# EAGLE schematic Daughter Card (EAGLE 6.5.1)
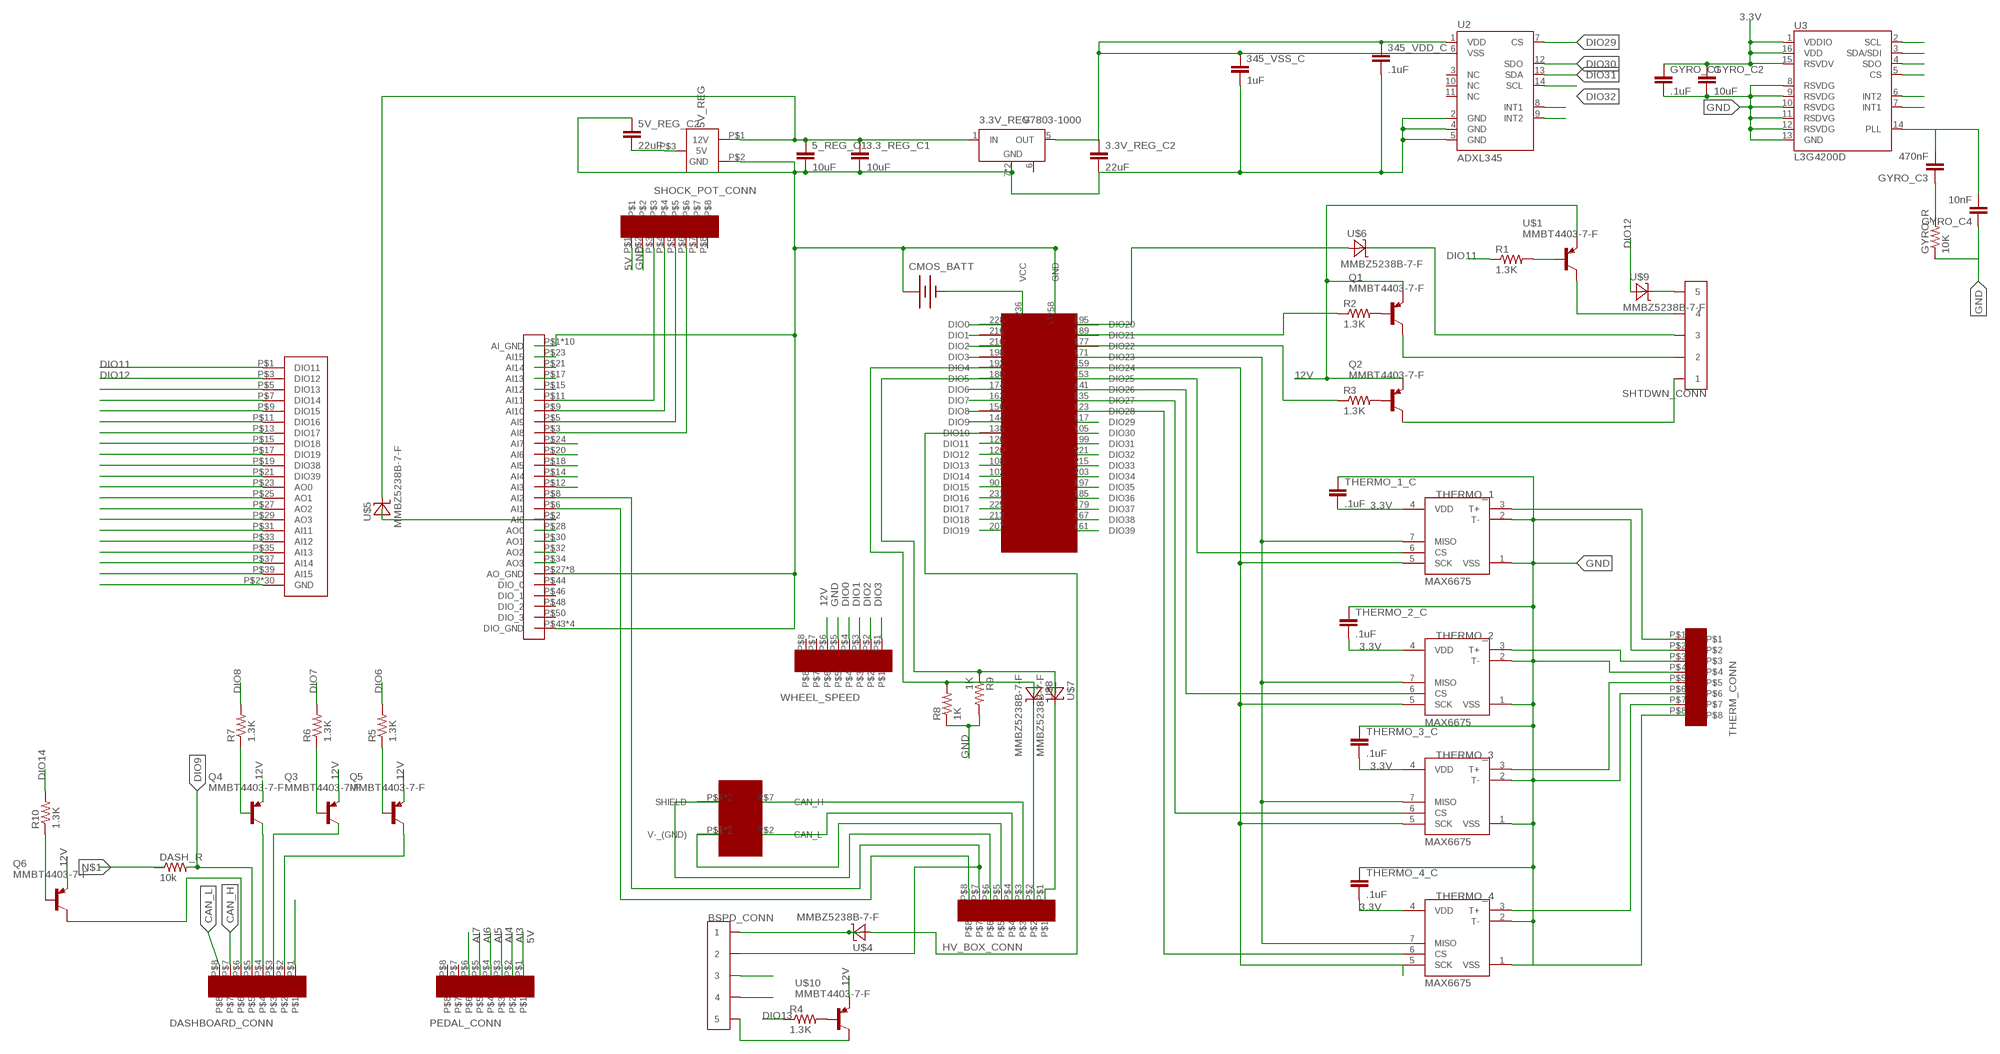
[diagram p0: schematic, sheet 1]

## Parts
3.3_REG_C1  10uF  CAP0603-CAP  [0603-CAP]
3.3V_REG  V7803-1000  [V78XX-1000]
3.3V_REG_C2  22uF  CAP0603-CAP  [0603-CAP]
5_REG_C1  10uF  CAP0603-CAP  [0603-CAP]
5V_REG  V78XX-1500  [V78XX-1500R]
5V_REG_C2  22uF  CAP0603-CAP  [0603-CAP]
345_VDD_C  .1uF  CAP0603-CAP  [0603-CAP]
345_VSS_C  1uF  CAP0603-CAP  [0603-CAP]
BSPD_CONN  CONN_5  [CONNECTOR_5]
CMOS_BATT  BATTERY20PTH  [BATTCOM_20MM_PTH]
DASH_R  10k  10K-1%RES-00824  [0603-RES]
DASHBOARD_CONN  EN3_PCB_8  [EN3_PCB_8]
GYRO_C1  .1uF  CAP0603-CAP  [0603-CAP]
GYRO_C2  10uF  CAP0603-CAP  [0603-CAP]
GYRO_C3  470nF  CAP0603-CAP  [0603-CAP]
GYRO_C4  10nF  CAP0603-CAP  [0603-CAP]
GYRO_R  10K  RESISTOR0603-RES  [0603-RES]
HV_BOX_CONN  EN3_PCB_8  [EN3_PCB_8]
PEDAL_CONN  EN3_PCB_8  [EN3_PCB_8]
Q1  MMBT4403-7-F  [SOT-23-3]
Q2  MMBT4403-7-F  [SOT-23-3]
Q3  MMBT4403-7-F  [SOT-23-3]
Q4  MMBT4403-7-F  [SOT-23-3]
Q5  MMBT4403-7-F  [SOT-23-3]
Q6  MMBT4403-7-F  [SOT-23-3]
R1  1.3K  R-US_R0402  [R0402]
R2  1.3K  R-US_R0402  [R0402]
R3  1.3K  R-US_R0402  [R0402]
R4  1.3K  R-US_R0402  [R0402]
R5  1.3K  R-US_R0402  [R0402]
R6  1.3K  R-US_R0402  [R0402]
R7  1.3K  R-US_R0402  [R0402]
R8  1K  R-US_R0402  [R0402]
R9  1K  R-US_R0402  [R0402]
R10  1.3K  R-US_R0402  [R0402]
SBRIO_ANALOG  SBRIO_MIO  [SBRIO_J502_J503]
SBRIO_AUX  SBRIO_AUX  [SBRIO_J502_J503]
SHOCK_POT_CONN  EN3_PCB_8  [EN3_PCB_8]
SHTDWN_CONN  CONN_5  [CONNECTOR_5]
THERM_CONN  EN3_PCB_8  [EN3_PCB_8]
THERMO_1  MAX6675  [SO08]
THERMO_1_C  .1uF  CAP0603-CAP  [0603-CAP]
THERMO_2  MAX6675  [SO08]
THERMO_2_C  .1uF  CAP0603-CAP  [0603-CAP]
THERMO_3  MAX6675  [SO08]
THERMO_3_C  .1uF  CAP0603-CAP  [0603-CAP]
THERMO_4  MAX6675  [SO08]
THERMO_4_C  .1uF  CAP0603-CAP  [0603-CAP]
U2  ADXL345  [LGA14]
U3  L3G4200D  [LGA16-4X4]
U$1  MMBT4403-7-F  [SOT-23-3]
U$2  SBRIO_W500  [SBRIO_W]
U$3  SBRIO_RMC  [SEAM-40-XX.X-XX-06-X-A]
U$4  MMBZ5238B-7-F  [SOT-23-3]
U$5  MMBZ5238B-7-F  [SOT-23-3]
U$6  MMBZ5238B-7-F  [SOT-23-3]
U$7  MMBZ5238B-7-F  [SOT-23-3]
U$8  MMBZ5238B-7-F  [SOT-23-3]
U$9  MMBZ5238B-7-F  [SOT-23-3]
U$10  MMBT4403-7-F  [SOT-23-3]
WHEEL_SPEED  EN3_PCB_8  [EN3_PCB_8]

## Nets
3.3V: 3.3V_REG.5(OUT) 3.3V_REG_C2.1 345_VDD_C.1 345_VSS_C.1 GYRO_C1.1 GYRO_C2.1 THERMO_1.4(VDD) THERMO_1_C.2 THERMO_2.4(VDD) THERMO_2_C.2 THERMO_3.4(VDD) THERMO_3_C.2 THERMO_4.4(VDD) THERMO_4_C.2 U2.1(VDD) U2.6(VSS) U3.1(VDDIO) U3.15(RSVDV) U3.16(VDD)
5V: 5V_REG.P$3(5V) 5V_REG_C2.2 DASHBOARD_CONN.P$1 PEDAL_CONN.P$1 SHOCK_POT_CONN.P$1
12V: 3.3_REG_C1.1 3.3V_REG.1(IN) 5_REG_C1.1 5V_REG.P$1(12V) Q1.P$3(E) Q2.P$3(E) Q3.P$3(E) Q4.P$3(E) Q5.P$3(E) Q6.P$3(E) U$1.P$3(E) U$5.P$1(C) U$10.P$3(E) WHEEL_SPEED.P$6
AI3: BSPD_CONN.5 BSPD_CONN.6 PEDAL_CONN.P$2 SBRIO_ANALOG.P$12(AI3)
AI4: BSPD_CONN.7 BSPD_CONN.8 PEDAL_CONN.P$3 SBRIO_ANALOG.P$14(AI4)
AI5: PEDAL_CONN.P$4 SBRIO_ANALOG.P$18(AI5)
AI6: PEDAL_CONN.P$5 SBRIO_ANALOG.P$20(AI6)
AI7: PEDAL_CONN.P$6 SBRIO_ANALOG.P$24(AI7)
AI11: SBRIO_ANALOG.P$11(AI11) SBRIO_AUX.P$31(AI11) SHOCK_POT_CONN.P$3
AI12: SBRIO_ANALOG.P$15(AI12) SBRIO_AUX.P$33(AI12)
AI13: SBRIO_ANALOG.P$17(AI13) SBRIO_AUX.P$35(AI13)
AI14: SBRIO_ANALOG.P$21(AI14) SBRIO_AUX.P$37(AI14)
AI15: SBRIO_ANALOG.P$23(AI15) SBRIO_AUX.P$39(AI15)
AO0: SBRIO_ANALOG.P$28(AO0) SBRIO_AUX.P$23(AO0)
AO1: SBRIO_ANALOG.P$30(AO1) SBRIO_AUX.P$25(AO1)
AO2: SBRIO_ANALOG.P$32(AO2) SBRIO_AUX.P$27(AO2)
AO3: SBRIO_ANALOG.P$34(AO3) SBRIO_AUX.P$29(AO3)
CAN_H: DASHBOARD_CONN.P$7 HV_BOX_CONN.P$3 U$2.P$7(CAN_H)
CAN_L: DASHBOARD_CONN.P$8 HV_BOX_CONN.P$4 U$2.P$2(CAN_L)
DIO0: U$3.228(DIO0) WHEEL_SPEED.P$4
DIO1: U$3.216(DIO1) WHEEL_SPEED.P$3
DIO2: U$3.210(DIO2) WHEEL_SPEED.P$2
DIO3: U$3.198(DIO3) WHEEL_SPEED.P$1
DIO6: R5.2 U$3.174(DIO6)
DIO7: R6.2 U$3.162(DIO7)
DIO8: R7.2 U$3.156(DIO8)
DIO9: DASH_R.2 DASHBOARD_CONN.P$5 U$3.144(DIO9)
DIO11: R1.1 SBRIO_AUX.P$1(DIO11) U$3.126(DIO11)
DIO12: SBRIO_AUX.P$3(DIO12) U$3.120(DIO12) U$9.P$2(A)
DIO13: R4.1 SBRIO_AUX.P$5(DIO13) U$3.108(DIO13)
DIO14: R10.2 SBRIO_AUX.P$7(DIO14) U$3.102(DIO14)
DIO15: SBRIO_AUX.P$9(DIO15) U$3.90(DIO15)
DIO16: SBRIO_AUX.P$11(DIO16) U$3.231(DIO16)
DIO17: SBRIO_AUX.P$13(DIO17) U$3.225(DIO17)
DIO18: SBRIO_AUX.P$15(DIO18) U$3.213(DIO18)
DIO19: SBRIO_AUX.P$17(DIO19) U$3.207(DIO19)
DIO29: U2.7(CS) U$3.117(DIO29)
DIO30: U2.12(SDO) U3.4(SDO) U$3.105(DIO30)
DIO31: U2.13(SDA) U3.3(SDA/SDI) U$3.99(DIO31)
DIO32: U2.14(SCL) U3.2(SCL) U$3.221(DIO32)
DIO33: U3.5(CS) U$3.215(DIO33)
DIO34: U3.7(INT1) U$3.203(DIO34)
DIO35: U3.6(INT2) U$3.197(DIO35)
DIO36: U2.8(INT1) U$3.185(DIO36)
DIO37: U2.9(INT2) U$3.179(DIO37)
DIO38: SBRIO_AUX.P$19(DIO38) U$3.167(DIO38)
DIO39: SBRIO_AUX.P$21(DIO39) U$3.161(DIO39)
GND: 3.3_REG_C1.2 3.3V_REG.7(GND) 3.3V_REG.9(GND) 3.3V_REG_C2.2 5_REG_C1.2 5V_REG.P$2(GND) 5V_REG_C2.1 345_VDD_C.2 345_VSS_C.2 CMOS_BATT.1(+) GYRO_C1.2 GYRO_C2.2 GYRO_C4.1 GYRO_R.1 R8.1 R9.2 SBRIO_ANALOG.P$1(AI_GND) SBRIO_ANALOG.P$4(AI_GND) SBRIO_ANALOG.P$7(AI_GND) SBRIO_ANALOG.P$10(AI_GND) SBRIO_ANALOG.P$13(AI_GND) SBRIO_ANALOG.P$16(AI_GND) SBRIO_ANALOG.P$19(AI_GND) SBRIO_ANALOG.P$22(AI_GND) SBRIO_ANALOG.P$25(AI_GND) SBRIO_ANALOG.P$26(AI_GND) SBRIO_ANALOG.P$27(AO_GND) SBRIO_ANALOG.P$29(AO_GND) SBRIO_ANALOG.P$31(AO_GND) SBRIO_ANALOG.P$33(AO_GND) SBRIO_ANALOG.P$35(AO_GND) SBRIO_ANALOG.P$37(AO_GND) SBRIO_ANALOG.P$39(AO_GND) SBRIO_ANALOG.P$41(AO_GND) SBRIO_ANALOG.P$43(DIO_GND) SBRIO_ANALOG.P$45(DIO_GND) SBRIO_ANALOG.P$47(DIO_GND) SBRIO_ANALOG.P$49(DIO_GND) SBRIO_AUX.P$2(GND) SBRIO_AUX.P$4(GND) SBRIO_AUX.P$6(GND) SBRIO_AUX.P$8(GND) SBRIO_AUX.P$10(GND) SBRIO_AUX.P$12(GND) SBRIO_AUX.P$14(GND) SBRIO_AUX.P$16(GND) SBRIO_AUX.P$18(GND) SBRIO_AUX.P$20(GND) SBRIO_AUX.P$22(GND) SBRIO_AUX.P$24(GND) SBRIO_AUX.P$26(GND) SBRIO_AUX.P$28(GND) SBRIO_AUX.P$30(GND) SBRIO_AUX.P$32(GND) SBRIO_AUX.P$34(GND) SBRIO_AUX.P$36(GND) SBRIO_AUX.P$38(GND) SBRIO_AUX.P$40(GND) SBRIO_AUX.P$41(GND) SBRIO_AUX.P$42(GND) SBRIO_AUX.P$43(GND) SBRIO_AUX.P$44(GND) SBRIO_AUX.P$45(GND) SBRIO_AUX.P$46(GND) SBRIO_AUX.P$47(GND) SBRIO_AUX.P$48(GND) SBRIO_AUX.P$49(GND) SBRIO_AUX.P$50(GND) SHOCK_POT_CONN.P$2 THERM_CONN.P$2 THERM_CONN.P$4 THERMO_1.1(VSS) THERMO_1.2(T-) THERMO_1_C.1 THERMO_2.1(VSS) THERMO_2.2(T-) THERMO_2_C.1 THERMO_3.1(VSS) THERMO_3.2(T-) THERMO_3_C.1 THERMO_4.1(VSS) THERMO_4.2(T-) THERMO_4_C.1 U2.2(GND) U2.4(GND) U2.5(GND) U3.8(RSVDG) U3.9(RSVDG) U3.10(RSVDG) U3.11(RSDVG) U3.12(RSVDG) U3.13(GND) U$3.17(GND) U$3.23(GND) U$3.30(GND) U$3.36(GND) U$3.41(GND) U$3.47(GND) U$3.78(GND) U$3.83(GND) U$3.88(GND) U$3.93(GND) U$3.96(GND) U$3.98(GND) U$3.101(GND) U$3.103(GND) U$3.106(GND) U$3.111(GND) U$3.114(GND) U$3.116(GND) U$3.119(GND) U$3.121(GND) U$3.124(GND) U$3.129(GND) U$3.132(GND) U$3.134(GND) U$3.137(GND) U$3.139(GND) U$3.142(GND) U$3.147(GND) U$3.150(GND) U$3.152(GND) U$3.155(GND) U$3.157(GND) U$3.160(GND) U$3.165(GND) U$3.168(GND) U$3.170(GND) U$3.173(GND) U$3.175(GND) U$3.178(GND) U$3.183(GND) U$3.186(GND) U$3.188(GND) U$3.191(GND) U$3.193(GND) U$3.196(GND) U$3.201(GND) U$3.204(GND) U$3.206(GND) U$3.209(GND) U$3.211(GND) U$3.214(GND) U$3.219(GND) U$3.222(GND) U$3.224(GND) U$3.227(GND) U$3.229(GND) U$3.232(GND) U$3.237(GND) WHEEL_SPEED.P$5
N$: Q4.P$2(B) R7.1
N$1: DASH_R.1
N$2: CMOS_BATT.2(-) U$3.236(VCC)
N$3: DASHBOARD_CONN.P$6 Q6.P$1(C)
N$4: SBRIO_ANALOG.P$2(AI0) U$5.P$2(A)
N$5: Q6.P$2(B) R10.1
N$7: Q1.P$1(C) SHTDWN_CONN.3 SHTDWN_CONN.4
N$8: Q2.P$1(C) SHTDWN_CONN.1 SHTDWN_CONN.2
N$9: SHTDWN_CONN.5 SHTDWN_CONN.6 U$6.P$1(C)
N$10: U$3.195(DIO20) U$6.P$2(A)
N$11: R2.1 U$3.189(DIO21)
N$12: R3.1 U$3.177(DIO22)
N$13: HV_BOX_CONN.P$1 U$7.P$1(C)
N$14: HV_BOX_CONN.P$2 U$8.P$1(C)
N$15: R8.2 U$3.192(DIO4) U$8.P$2(A)
N$16: R9.1 U$3.180(DIO5) U$7.P$2(A)
N$17: THERMO_1.7(MISO) THERMO_2.7(MISO) THERMO_3.7(MISO) U$3.171(DIO23)
N$18: THERMO_1.5(SCK) THERMO_2.5(SCK) THERMO_3.5(SCK) U$3.159(DIO24)
N$19: HV_BOX_CONN.P$5 U$2.P$3(V-_(GND)) U$2.P$6(V-_(GND))
N$20: HV_BOX_CONN.P$8 SBRIO_ANALOG.P$6(AI1)
N$21: BSPD_CONN.3 BSPD_CONN.4 HV_BOX_CONN.P$7 SBRIO_ANALOG.P$8(AI2)
N$22: DASHBOARD_CONN.P$2 Q5.P$1(C)
N$23: DASHBOARD_CONN.P$3 Q3.P$1(C)
N$24: DASHBOARD_CONN.P$4 Q4.P$1(C)
N$25: THERMO_1.6(CS) U$3.153(DIO25)
N$26: U$3.141(DIO26)
N$27: THERMO_3.6(CS) U$3.135(DIO27)
N$28: THERMO_4.6(CS) U$3.123(DIO28)
N$29: THERM_CONN.P$1 THERMO_1.3(T+)
N$30: THERM_CONN.P$3 THERMO_2.3(T+)
N$31: THERM_CONN.P$5 THERMO_3.3(T+)
N$32: THERM_CONN.P$7 THERMO_4.3(T+)
N$33: SHTDWN_CONN.9 SHTDWN_CONN.10 U$9.P$1(C)
N$34: SBRIO_ANALOG.P$9(AI10) SHOCK_POT_CONN.P$4
N$35: SBRIO_ANALOG.P$5(AI9) SHOCK_POT_CONN.P$5
N$36: SBRIO_ANALOG.P$3(AI8) SHOCK_POT_CONN.P$6
N$37: GYRO_C3.2 GYRO_C4.2 U3.14(PLL)
N$38: GYRO_C3.1 GYRO_R.2
N$42: BSPD_CONN.1 BSPD_CONN.2 U$4.P$1(C)
N$43: U$3.138(DIO10) U$4.P$2(A)
N$44: SHTDWN_CONN.7 SHTDWN_CONN.8 U$1.P$1(C)
N$45: BSPD_CONN.9 BSPD_CONN.10 U$10.P$1(C)
N$46: R1.2 U$1.P$2(B)
N$47: Q1.P$2(B) R2.2
N$48: Q2.P$2(B) R3.2
N$49: R4.2 U$10.P$2(B)
N$50: Q5.P$2(B) R5.1
N$51: Q3.P$2(B) R6.1
SHIELD: HV_BOX_CONN.P$6 U$2.P$5(SHIELD) U$2.P$10(SHIELD)
Unconnected: 3.3V_REG.6 PEDAL_CONN.P$7 PEDAL_CONN.P$8 SBRIO_ANALOG.P$44(DIO_0) SBRIO_ANALOG.P$46(DIO_1) SBRIO_ANALOG.P$48(DIO_2) SBRIO_ANALOG.P$50(DIO_3) SHOCK_POT_CONN.P$7 SHOCK_POT_CONN.P$8 THERM_CONN.P$6 THERM_CONN.P$8 THERMO_2.6(CS) THERMO_4.5(SCK) THERMO_4.7(MISO) U2.3(NC) U2.10(NC) U2.11(NC) WHEEL_SPEED.P$7 WHEEL_SPEED.P$8

## Library data of the parts
3.3_REG_C1 3.3V_REG_C2 5_REG_C1 5V_REG_C2 345_VDD_C 345_VSS_C GYRO_C1-GYRO_C4 THERMO_1_C THERMO_2_C THERMO_3_C THERMO_4_C = SparkFun-Passives:CAP: Capacitor Standard 0603 ceramic capacitor, and 0.1" leaded capacitor.
3.3V_REG = formula electric:V7803-1000
5V_REG = formula electric:V78XX-1500
BSPD_CONN SHTDWN_CONN = formula electric:CONN_5
CMOS_BATT = SparkFun-Electromechanical:BATTERY: Battery Holders Various common sizes : AA, AAA, 20mm coin cell and 12mm coin cell. 20MM_4LEGS, BATT-10373
DASH_R = SparkFun-Resistors:10K-1%: 10k-ohm SMT 1/10W - 1% (0603) RES-00824; PROD_ID: RES-00824
DASHBOARD_CONN HV_BOX_CONN PEDAL_CONN SHOCK_POT_CONN THERM_CONN WHEEL_SPEED = formula electric:EN3_PCB_8
GYRO_R = SparkFun-Passives:RESISTOR: Resistor Basic schematic elements and footprints for 0603, 1206, and PTH resistors.
Q1-Q6 U$1 U$10 = formula electric:MMBT4403-7-F
R1-R10 = resistor:R-US_: RESISTOR, American symbol
SBRIO_ANALOG = formula electric:SBRIO_MIO
SBRIO_AUX = formula electric:SBRIO_AUX: An output for a lot of the extra pins on the sbRIO.
THERMO_1-THERMO_4 = max6675:MAX6675
U2 = SparkFun-Sensors:ADXL345: 3-axis SPI/I2C 2/4/8/16g accelerometer
U3 = SparkFun-Sensors:L3G4200D: L3G4200D Three-axis, digital output gyroscope The L3G4200D is a low-power three-axis angular rate sensor, has a full scale of ±250/±500/±2000 dps and is capable of measuring rates with a user-selectable bandwidth. It includes a sensing element and an IC interface capable of providing the measured angular rate to the external world through a digital interface (I2C/SPI). Package: 4x4x1.1 LGA-16 (LGA16-4x4.PAC)
U$2 = formula electric:SBRIO_W500
U$3 = SEAM-40-XX.X-XX-06-X-A:SBRIO_RMC
U$4-U$9 = formula electric:MMBZ5238B-7-F: Digikey: MMBZ5238B-FDICT-ND

## Net classes
0 default: clearance 0.205 mm